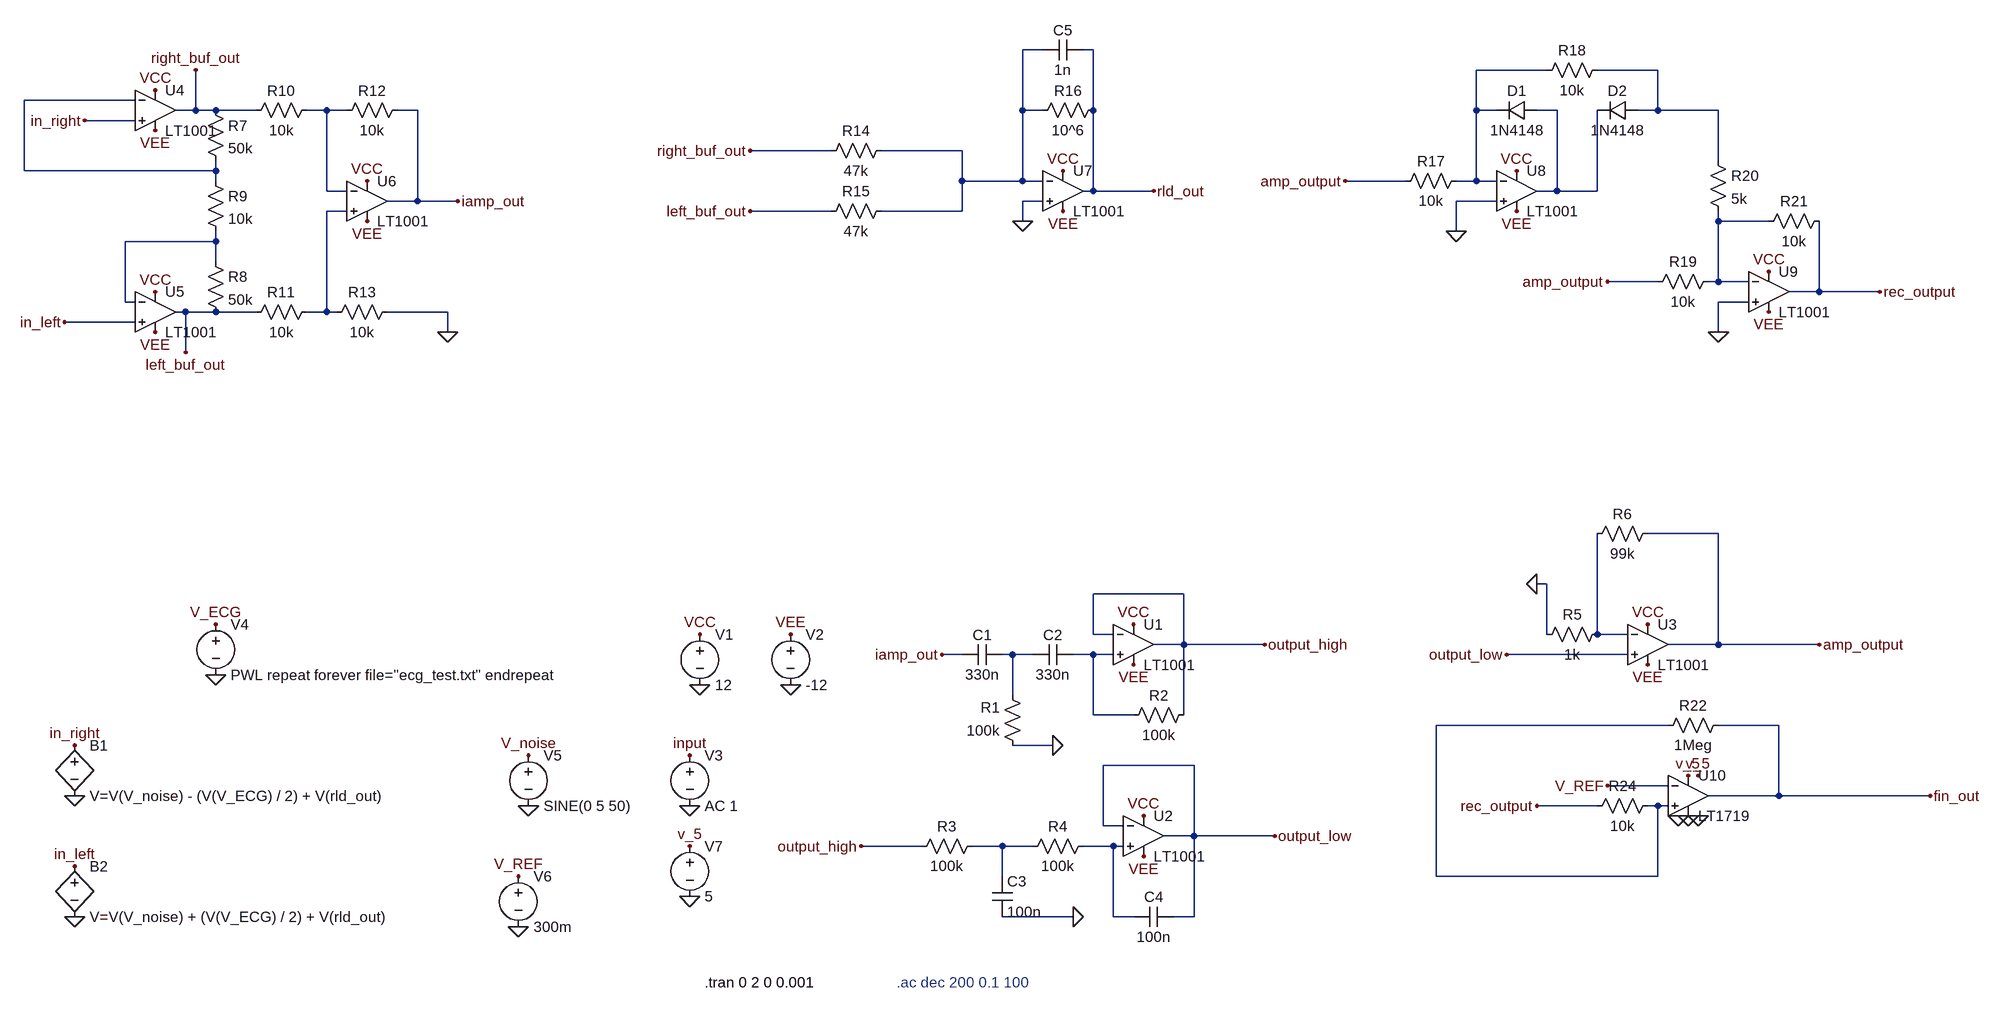
[diagram p0: schematic QRS.asc]
QRS.asc, the LTspice schematic file:
Version 4
SHEET 1 2796 980
WIRE 128 -688 96 -688
WIRE 208 -688 192 -688
WIRE 928 -656 816 -656
WIRE 1104 -656 1008 -656
WIRE -1312 -608 -1488 -608
WIRE -1216 -592 -1216 -656
WIRE -1216 -592 -1248 -592
WIRE -1184 -592 -1216 -592
WIRE -1120 -592 -1184 -592
WIRE -1008 -592 -1040 -592
WIRE -976 -592 -1008 -592
WIRE -864 -592 -896 -592
WIRE 96 -592 96 -688
WIRE 128 -592 96 -592
WIRE 208 -592 208 -688
WIRE 816 -592 816 -656
WIRE 848 -592 816 -592
WIRE 944 -592 912 -592
WIRE 1104 -592 1104 -656
WIRE 1104 -592 1072 -592
WIRE 1200 -592 1104 -592
WIRE -1312 -576 -1392 -576
WIRE -208 -528 -336 -528
WIRE 0 -528 -128 -528
WIRE 1200 -512 1200 -592
WIRE -1488 -496 -1488 -608
WIRE -1184 -496 -1184 -512
WIRE -1184 -496 -1488 -496
WIRE -1184 -480 -1184 -496
WIRE 0 -480 0 -528
WIRE 96 -480 96 -592
WIRE 96 -480 0 -480
WIRE 128 -480 96 -480
WIRE 704 -480 608 -480
WIRE 816 -480 816 -592
WIRE 816 -480 784 -480
WIRE 848 -480 816 -480
WIRE -1008 -464 -1008 -592
WIRE -976 -464 -1008 -464
WIRE 208 -464 208 -592
WIRE 208 -464 192 -464
WIRE 304 -464 208 -464
WIRE 944 -464 944 -592
WIRE 944 -464 912 -464
WIRE 1008 -464 1008 -592
WIRE 1008 -464 944 -464
WIRE -864 -448 -864 -592
WIRE -864 -448 -912 -448
WIRE -800 -448 -864 -448
WIRE 128 -448 96 -448
WIRE 848 -448 784 -448
WIRE -976 -432 -1008 -432
WIRE -208 -432 -336 -432
WIRE 0 -432 0 -480
WIRE 0 -432 -128 -432
WIRE 96 -416 96 -448
WIRE 1200 -416 1200 -432
WIRE 1280 -416 1200 -416
WIRE 784 -400 784 -448
WIRE -1184 -384 -1184 -400
WIRE -1184 -384 -1328 -384
WIRE -1184 -352 -1184 -384
WIRE 1104 -320 1024 -320
WIRE 1200 -320 1200 -416
WIRE 1200 -320 1184 -320
WIRE 1248 -320 1200 -320
WIRE 1360 -304 1360 -416
WIRE 1360 -304 1312 -304
WIRE 1456 -304 1360 -304
WIRE -1328 -288 -1328 -384
WIRE -1312 -288 -1328 -288
WIRE 1248 -288 1200 -288
WIRE -1232 -272 -1248 -272
WIRE -1184 -272 -1232 -272
WIRE -1120 -272 -1184 -272
WIRE -1008 -272 -1008 -432
WIRE -1008 -272 -1040 -272
WIRE -992 -272 -1008 -272
WIRE -816 -272 -912 -272
WIRE -1312 -256 -1424 -256
WIRE -816 -240 -816 -272
WIRE 1200 -240 1200 -288
WIRE -1232 -208 -1232 -272
WIRE 1200 80 1088 80
WIRE 928 160 912 160
WIRE 352 176 208 176
WIRE 208 240 208 176
WIRE 240 240 208 240
WIRE 928 240 928 160
WIRE 1008 240 1008 80
WIRE 1056 240 1008 240
WIRE 352 256 352 176
WIRE 352 256 304 256
WIRE 480 256 352 256
WIRE 1200 256 1200 80
WIRE 1200 256 1120 256
WIRE 1360 256 1200 256
WIRE 0 272 -32 272
WIRE 80 272 64 272
WIRE 112 272 80 272
WIRE 208 272 176 272
WIRE 240 272 208 272
WIRE 1056 272 864 272
WIRE 80 336 80 272
WIRE 208 368 208 272
WIRE 272 368 208 368
WIRE 352 368 352 256
WIRE 1120 384 752 384
WIRE 1296 384 1200 384
WIRE 144 416 80 416
WIRE 368 448 224 448
WIRE 1120 480 1024 480
WIRE 1296 496 1296 384
WIRE 1296 496 1184 496
WIRE 1536 496 1296 496
WIRE 1008 512 912 512
WIRE 1104 512 1088 512
WIRE 1120 512 1104 512
WIRE 224 544 224 448
WIRE 256 544 224 544
WIRE 368 560 368 448
WIRE 368 560 320 560
WIRE 496 560 368 560
WIRE -64 576 -160 576
WIRE 64 576 16 576
WIRE 112 576 64 576
WIRE 240 576 192 576
WIRE 256 576 240 576
WIRE 64 624 64 576
WIRE 752 624 752 384
WIRE 1104 624 1104 512
WIRE 1104 624 752 624
WIRE 176 688 64 688
WIRE 240 688 240 576
WIRE 272 688 240 688
WIRE 368 688 368 560
WIRE 368 688 336 688
FLAG -32 272 iamp_out
FLAG 144 416 0
FLAG 480 256 output_high
FLAG 176 688 0
FLAG -160 576 output_high
FLAG 496 560 output_low
FLAG -416 320 0
FLAG -272 320 0
FLAG -416 240 VCC
FLAG -272 240 VEE
FLAG 272 224 VCC
FLAG 288 528 VCC
FLAG 272 288 VEE
FLAG 288 592 VEE
FLAG -432 432 input
FLAG -432 512 0
FLAG 912 160 0
FLAG 864 272 output_low
FLAG 1360 256 amp_output
FLAG 1088 224 VCC
FLAG 1088 288 VEE
FLAG -1424 -256 in_left
FLAG -1392 -576 in_right
FLAG -816 -240 0
FLAG -800 -448 iamp_out
FLAG -1216 -656 right_buf_out
FLAG -1232 -208 left_buf_out
FLAG -1280 -240 VEE
FLAG -1280 -560 VEE
FLAG -944 -416 VEE
FLAG -944 -480 VCC
FLAG -1280 -304 VCC
FLAG -1280 -624 VCC
FLAG -336 -528 right_buf_out
FLAG -336 -432 left_buf_out
FLAG 160 -432 VEE
FLAG 160 -496 VCC
FLAG 96 -416 0
FLAG 304 -464 rld_out
FLAG -1184 304 0
FLAG -1184 224 V_ECG
FLAG -1408 688 0
FLAG -1408 496 0
FLAG -1408 416 in_right
FLAG -1408 608 in_left
FLAG -688 512 0
FLAG -688 432 V_noise
FLAG 608 -480 amp_output
FLAG 784 -400 0
FLAG 1024 -320 amp_output
FLAG 1200 -240 0
FLAG 1456 -304 rec_output
FLAG 1280 -272 VEE
FLAG 880 -432 VEE
FLAG 880 -496 VCC
FLAG 1280 -336 VCC
FLAG -704 704 0
FLAG -704 624 V_REF
FLAG -432 656 0
FLAG -432 576 v_5
FLAG 1024 480 V_REF
FLAG 912 512 rec_output
FLAG 1536 496 fin_out
FLAG 1168 464 v_5
FLAG 1152 464 v_5
FLAG 1136 528 0
FLAG 1152 528 0
FLAG 1168 528 0
SYMBOL OpAmps/LT1001 272 192 R0
SYMATTR InstName U1
SYMBOL OpAmps/LT1001 288 496 R0
SYMATTR InstName U2
SYMBOL Res 96 432 R180
WINDOW 0 36 76 Left 2
WINDOW 3 36 40 Left 2
SYMATTR InstName R1
SYMATTR Value 100k
SYMBOL Res 368 352 R90
WINDOW 0 0 56 VBottom 2
WINDOW 3 32 56 VTop 2
SYMATTR InstName R2
SYMATTR Value 100k
SYMBOL Cap 64 256 R90
WINDOW 0 0 32 VBottom 2
WINDOW 3 32 32 VTop 2
SYMATTR InstName C1
SYMATTR Value 330n
SYMBOL Cap 176 256 R90
WINDOW 0 0 32 VBottom 2
WINDOW 3 32 32 VTop 2
SYMATTR InstName C2
SYMATTR Value 330n
SYMBOL Res -80 592 R270
WINDOW 0 32 56 VTop 2
WINDOW 3 0 56 VBottom 2
SYMATTR InstName R3
SYMATTR Value 100k
SYMBOL Res 96 592 R270
WINDOW 0 32 56 VTop 2
WINDOW 3 0 56 VBottom 2
SYMATTR InstName R4
SYMATTR Value 100k
SYMBOL Cap 48 624 R0
SYMATTR InstName C3
SYMATTR Value 100n
SYMBOL Cap 272 704 R270
WINDOW 0 32 32 VTop 2
WINDOW 3 0 32 VBottom 2
SYMATTR InstName C4
SYMATTR Value 100n
SYMBOL Voltage -416 224 R0
SYMATTR InstName V1
SYMATTR Value 12
SYMBOL Voltage -272 224 R0
SYMATTR InstName V2
SYMATTR Value -12
SYMBOL Voltage -432 416 R0
SYMATTR InstName V3
SYMATTR Value AC 1
SYMBOL OpAmps/LT1001 1088 192 R0
SYMATTR InstName U3
SYMBOL Res 1024 224 R90
WINDOW 0 0 56 VBottom 2
WINDOW 3 32 56 VTop 2
SYMATTR InstName R5
SYMATTR Value 1k
SYMBOL Res 1104 64 R90
WINDOW 0 0 56 VBottom 2
WINDOW 3 32 56 VTop 2
SYMATTR InstName R6
SYMATTR Value 99k
SYMBOL Res -1200 -608 R0
SYMATTR InstName R7
SYMATTR Value 50k
SYMBOL Res -1200 -368 R0
SYMATTR InstName R8
SYMATTR Value 50k
SYMBOL Res -1200 -496 R0
SYMATTR InstName R9
SYMATTR Value 10k
SYMBOL Res -1024 -608 R90
WINDOW 0 0 56 VBottom 2
WINDOW 3 32 56 VTop 2
SYMATTR InstName R10
SYMATTR Value 10k
SYMBOL Res -1024 -288 R90
WINDOW 0 0 56 VBottom 2
WINDOW 3 32 56 VTop 2
SYMATTR InstName R11
SYMATTR Value 10k
SYMBOL Res -880 -608 R90
WINDOW 0 0 56 VBottom 2
WINDOW 3 32 56 VTop 2
SYMATTR InstName R12
SYMATTR Value 10k
SYMBOL Res -896 -288 R90
WINDOW 0 0 56 VBottom 2
WINDOW 3 32 56 VTop 2
SYMATTR InstName R13
SYMATTR Value 10k
SYMBOL OpAmps/LT1001 -1280 -656 R0
SYMATTR InstName U4
SYMBOL OpAmps/LT1001 -1280 -336 R0
SYMATTR InstName U5
SYMBOL OpAmps/LT1001 -944 -512 R0
SYMATTR InstName U6
SYMBOL Res -112 -544 R90
WINDOW 0 0 56 VBottom 2
WINDOW 3 32 56 VTop 2
SYMATTR InstName R14
SYMATTR Value 47k
SYMBOL Res -112 -448 R90
WINDOW 0 0 56 VBottom 2
WINDOW 3 32 56 VTop 2
SYMATTR InstName R15
SYMATTR Value 47k
SYMBOL OpAmps/LT1001 160 -528 R0
SYMATTR InstName U7
SYMBOL Res 224 -608 R90
WINDOW 0 0 56 VBottom 2
WINDOW 3 32 56 VTop 2
SYMATTR InstName R16
SYMATTR Value 10^6
SYMBOL Cap 192 -704 R90
WINDOW 0 0 32 VBottom 2
WINDOW 3 32 32 VTop 2
SYMATTR InstName C5
SYMATTR Value 1n
SYMBOL Voltage -1184 208 R0
SYMATTR InstName V4
SYMATTR Value PWL repeat forever file="ecg_test.txt" endrepeat
SYMBOL bv -1408 400 R0
SYMATTR InstName B1
SYMATTR Value V=V(V_noise) - (V(V_ECG) / 2) + V(rld_out)
SYMBOL bv -1408 592 R0
SYMATTR InstName B2
SYMATTR Value V=V(V_noise) + (V(V_ECG) / 2) + V(rld_out)
SYMBOL Voltage -688 416 R0
SYMATTR InstName V5
SYMATTR Value SINE(0 5 50)
SYMBOL OpAmps/LT1001 880 -528 R0
SYMATTR InstName U8
SYMBOL Res 800 -496 R90
WINDOW 0 0 56 VBottom 2
WINDOW 3 32 56 VTop 2
SYMATTR InstName R17
SYMATTR Value 10k
SYMBOL diode 912 -608 R90
WINDOW 0 0 32 VBottom 2
WINDOW 3 32 32 VTop 2
SYMATTR InstName D1
SYMATTR Value 1N4148
SYMBOL diode 1072 -608 R90
WINDOW 0 0 32 VBottom 2
WINDOW 3 32 32 VTop 2
SYMATTR InstName D2
SYMATTR Value 1N4148
SYMBOL Res 1024 -672 R90
WINDOW 0 0 56 VBottom 2
WINDOW 3 32 56 VTop 2
SYMATTR InstName R18
SYMATTR Value 10k
SYMBOL OpAmps/LT1001 1280 -368 R0
SYMATTR InstName U9
SYMBOL Res 1200 -336 R90
WINDOW 0 0 56 VBottom 2
WINDOW 3 32 56 VTop 2
SYMATTR InstName R19
SYMATTR Value 10k
SYMBOL Res 1184 -528 R0
SYMATTR InstName R20
SYMATTR Value 5k
SYMBOL Res 1376 -432 R90
WINDOW 0 0 56 VBottom 2
WINDOW 3 32 56 VTop 2
SYMATTR InstName R21
SYMATTR Value 10k
SYMBOL Voltage -704 608 R0
SYMATTR InstName V6
SYMATTR Value 300m
SYMBOL Voltage -432 560 R0
SYMATTR InstName V7
SYMATTR Value 5
SYMBOL Comparators/LT1719 1152 432 R0
SYMATTR InstName U10
SYMBOL Res 1216 368 R90
WINDOW 0 0 56 VBottom 2
WINDOW 3 32 56 VTop 2
SYMATTR InstName R22
SYMATTR Value 1Meg
SYMBOL Res 1104 496 R90
WINDOW 0 0 56 VBottom 2
WINDOW 3 32 56 VTop 2
SYMATTR InstName R24
SYMATTR Value 10k
TEXT -408 792 Left 2 !.tran 0 2 0 0.001
TEXT -104 792 Left 2 ;.ac dec 200 0.1 100

The netlist it stands for:
* QRS.asc
XU1 N012 output_high VCC VEE output_high LT1001  ; pins In+ In- V+ V- OUT
XU2 N015 output_low VCC VEE output_low LT1001  ; pins In+ In- V+ V- OUT
R1 0 N011 100k
R2 output_high N012 100k
C1 N011 iamp_out 330n
C2 N012 N011 330n
R3 output_high N014 100k
R4 N014 N015 100k
C3 N014 0 100n
C4 N015 output_low 100n
V1 VCC 0 12
V2 VEE 0 -12
V3 input 0 AC 1
XU3 output_low N010 VCC VEE amp_output LT1001  ; pins In+ In- V+ V- OUT
R5 N010 0 1k
R6 amp_output N010 99k
R7 right_buf_out N004 50k
R8 N009 left_buf_out 50k
R9 N004 N009 10k
R10 N005 right_buf_out 10k
R11 N007 left_buf_out 10k
R12 iamp_out N005 10k
R13 0 N007 10k
XU4 in_right N004 VCC VEE right_buf_out LT1001  ; pins In+ In- V+ V- OUT
XU5 in_left N009 VCC VEE left_buf_out LT1001  ; pins In+ In- V+ V- OUT
XU6 N007 N005 VCC VEE iamp_out LT1001  ; pins In+ In- V+ V- OUT
R14 N001 right_buf_out 47k
R15 N001 left_buf_out 47k
XU7 0 N001 VCC VEE rld_out LT1001  ; pins In+ In- V+ V- OUT
R16 rld_out N001 10^6
C5 rld_out N001 1n
V4 V_ECG 0 PWL repeat forever file="ecg_test.txt" endrepeat
B1 in_right 0 V=V(V_noise) - (V(V_ECG) / 2) + V(rld_out)
B2 in_left 0 V=V(V_noise) + (V(V_ECG) / 2) + V(rld_out)
V5 V_noise 0 SINE(0 5 50)
XU8 0 N002 VCC VEE N006 LT1001  ; pins In+ In- V+ V- OUT
R17 N002 amp_output 10k
D1 N006 N002 1N4148
D2 N003 N006 1N4148
R18 N003 N002 10k
XU9 0 N008 VCC VEE rec_output LT1001  ; pins In+ In- V+ V- OUT
R19 N008 amp_output 10k
R20 N003 N008 5k
R21 rec_output N008 10k
V6 V_REF 0 300m
V7 v_5 0 5
XU10 N013 V_REF v_5 0 fin_out LT1719  ; pins In+ In- V+ V- OUT
R22 fin_out N013 1Meg
R24 N013 rec_output 10k
.model D D
.lib standard.dio
.tran 0 2 0 0.001
* .ac dec 200 0.1 100
.lib LTC.lib
.backanno
.end